# Altium schematic sheet DS18B20.SchDoc
size A4; SheetNumber: 3; SheetTotal: 6
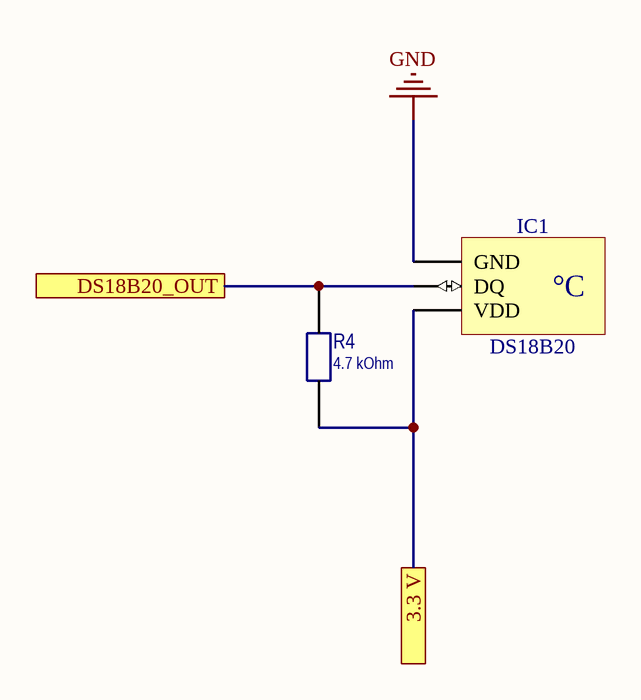
[diagram p0: DS18B20.SchDoc]

## Parts
IC1  DS18B20  [DS18B20]
R4  4.7 kOhm  [R_0805]

## Ports
3.3 V (see MainSheet[3C], BME280[2B], DC-DC_MC34063[1B], STM32F103C8T6[1C], TH02[1B]), DS18B20_OUT (see MainSheet[3C], STM32F103C8T6[2B])

## Nets
GND: IC1.1(GND)
3.3 V: IC1.3(VDD) R4.1 ; port 3.3 V
DS18B20_OUT: IC1.2(DQ) R4.2 ; port DS18B20_OUT

## Notes on the sheet
- (in symbol DS18B20+) °C

## Library data of the parts
IC1 = DS18B20+: Programmable Resolution 1-Wire Digital Thermometer
R4 = R0805: Resistor; Value: 4.7 kOhm